# EasyEDA Pro project grandPA2.eprj, board Key
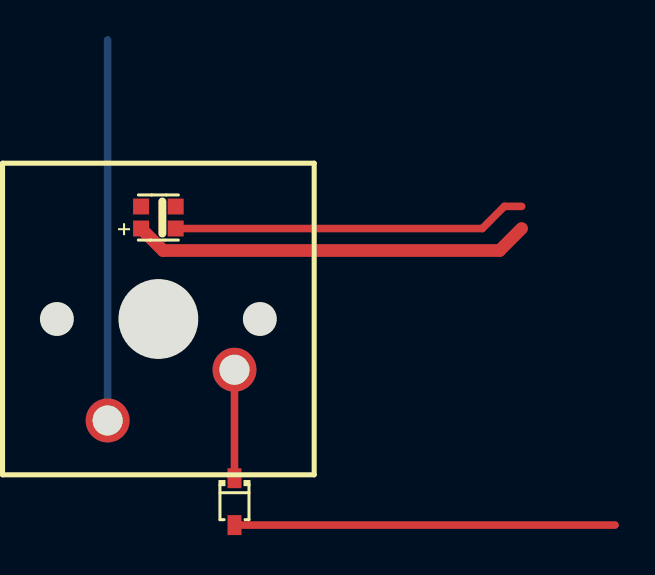
[diagram p6: board, top side]
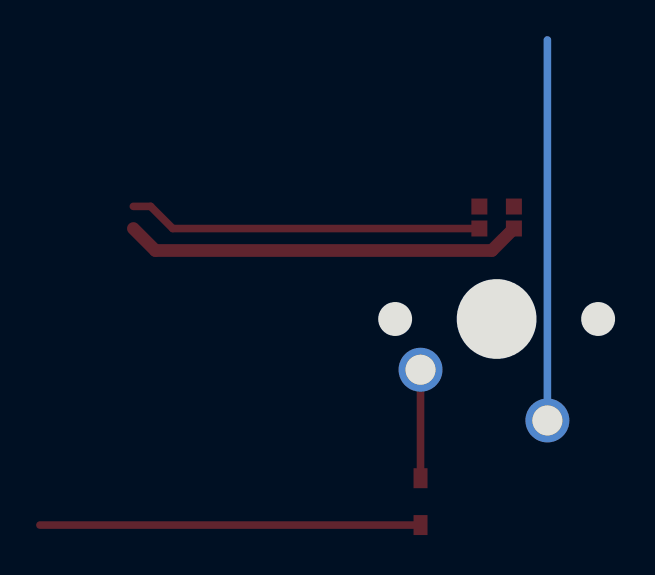
[diagram p7: board, bottom side, seen from below]

Outline 11.85 x 3.99 mm; copper layers: Top Layer, Bottom Layer. Coordinates in mm from the lower left corner of the outline.
Stack: Top Layer 0.035mm / Dielectric1 1.51mm FR4 er 4.5 / Bottom Layer 0.035mm

## Design rules (mm)
template: JLCPCB Capability(Two Layers Board)
spacing copperThickness1oz (default): track to track 0.102, other pairs 0.152 to 0.3
spacing copperThickness2oz: track to track 0.203, other pairs 0.152 to 0.3
track width copperThickness1oz (default): min 0.127, default 0.254, max 2.54
track width copperThickness2oz: min 0.203, default 0.254, max 2.54
differential pair differentialPair (default): width min 0.127, default 0.254, max 2.54; gap min 0.152, default 0.152
via viaSize (default): diameter min 0.5, default 0.61, max 10; hole min 0.3, default 0.305, max 6.3

## Placement (name value [footprint] x y rotation side)
D1  1N4148WS  [SOD-323_L1.8-W1.3-LS2.5-RD]  9.74 -7.15 270 top
LED1  WS2812B-2020-V6  [LED-SMD_4P-L2.2-W2.0-P1.00_WS2815C-2020-4P]  5.93 7.08 180 top
SW1  MX1A-11NW  [SW-TH_MX1A-11NW]  5.93 2 180 top

## Footprints (pads in the part's own frame, mm; a bottom-side part is the same pattern mirrored in y, then rotated)
LED-SMD_4P-L2.2-W2.0-P1.00_WS2815C-2020-4P
  rect 0.8x0.8 smd: 1(-0.865,0.55) 2(-0.865,-0.55) 3(0.865,-0.55) 4(0.865,0.55)
SOD-323_L1.8-W1.3-LS2.5-RD
  rect 1x0.7 smd: 1(-1.173,0) 2(1.173,0)
SW-TH_MX1A-11NW
  round 2.2 hole 1.5: 1(-3.81,2.54) 2(2.54,5.08)

## Nets
As in the schematic.

## Routing (per net, layer and track width the routed paths; a pad name or vN(x,y) marks a point on that pad's centre or on a via; arc(x,y) is an arc through that point)
VCC: length 20
  Top Layer w0.635: LED1.4 6.16,5.42 23.01,5.42 24.11,6.53
COL: length 19
  Bottom Layer w0.381: SW1.2 3.39,15.97
DO: length 17.7
  Top Layer w0.381: 24.11,7.63 23.25,7.63 22.14,6.53 6.92,6.53
ROW: length 19.1
  Top Layer w0.381: D1.2 28.79,-8.32
$1N2306: length 5.4
  Top Layer w0.381: SW1.1 D1.1
